# Altium schematic sheet Steering Wheel Carrier Board Mezzanine.SchDoc: Steering Wheel Interface - Mezzanine
size B; Organization: Midnight Sun Solar Rayce Car Team; Address1: University of Waterloo; Address2: 200 University Ave W; Address3: Waterloo, ON, Canada; Address4: N2L 3E9; DocumentNumber: 1; SheetNumber: 1; SheetTotal: 5; Website: www.uwmidsun.com; ProjectName: ProjectName
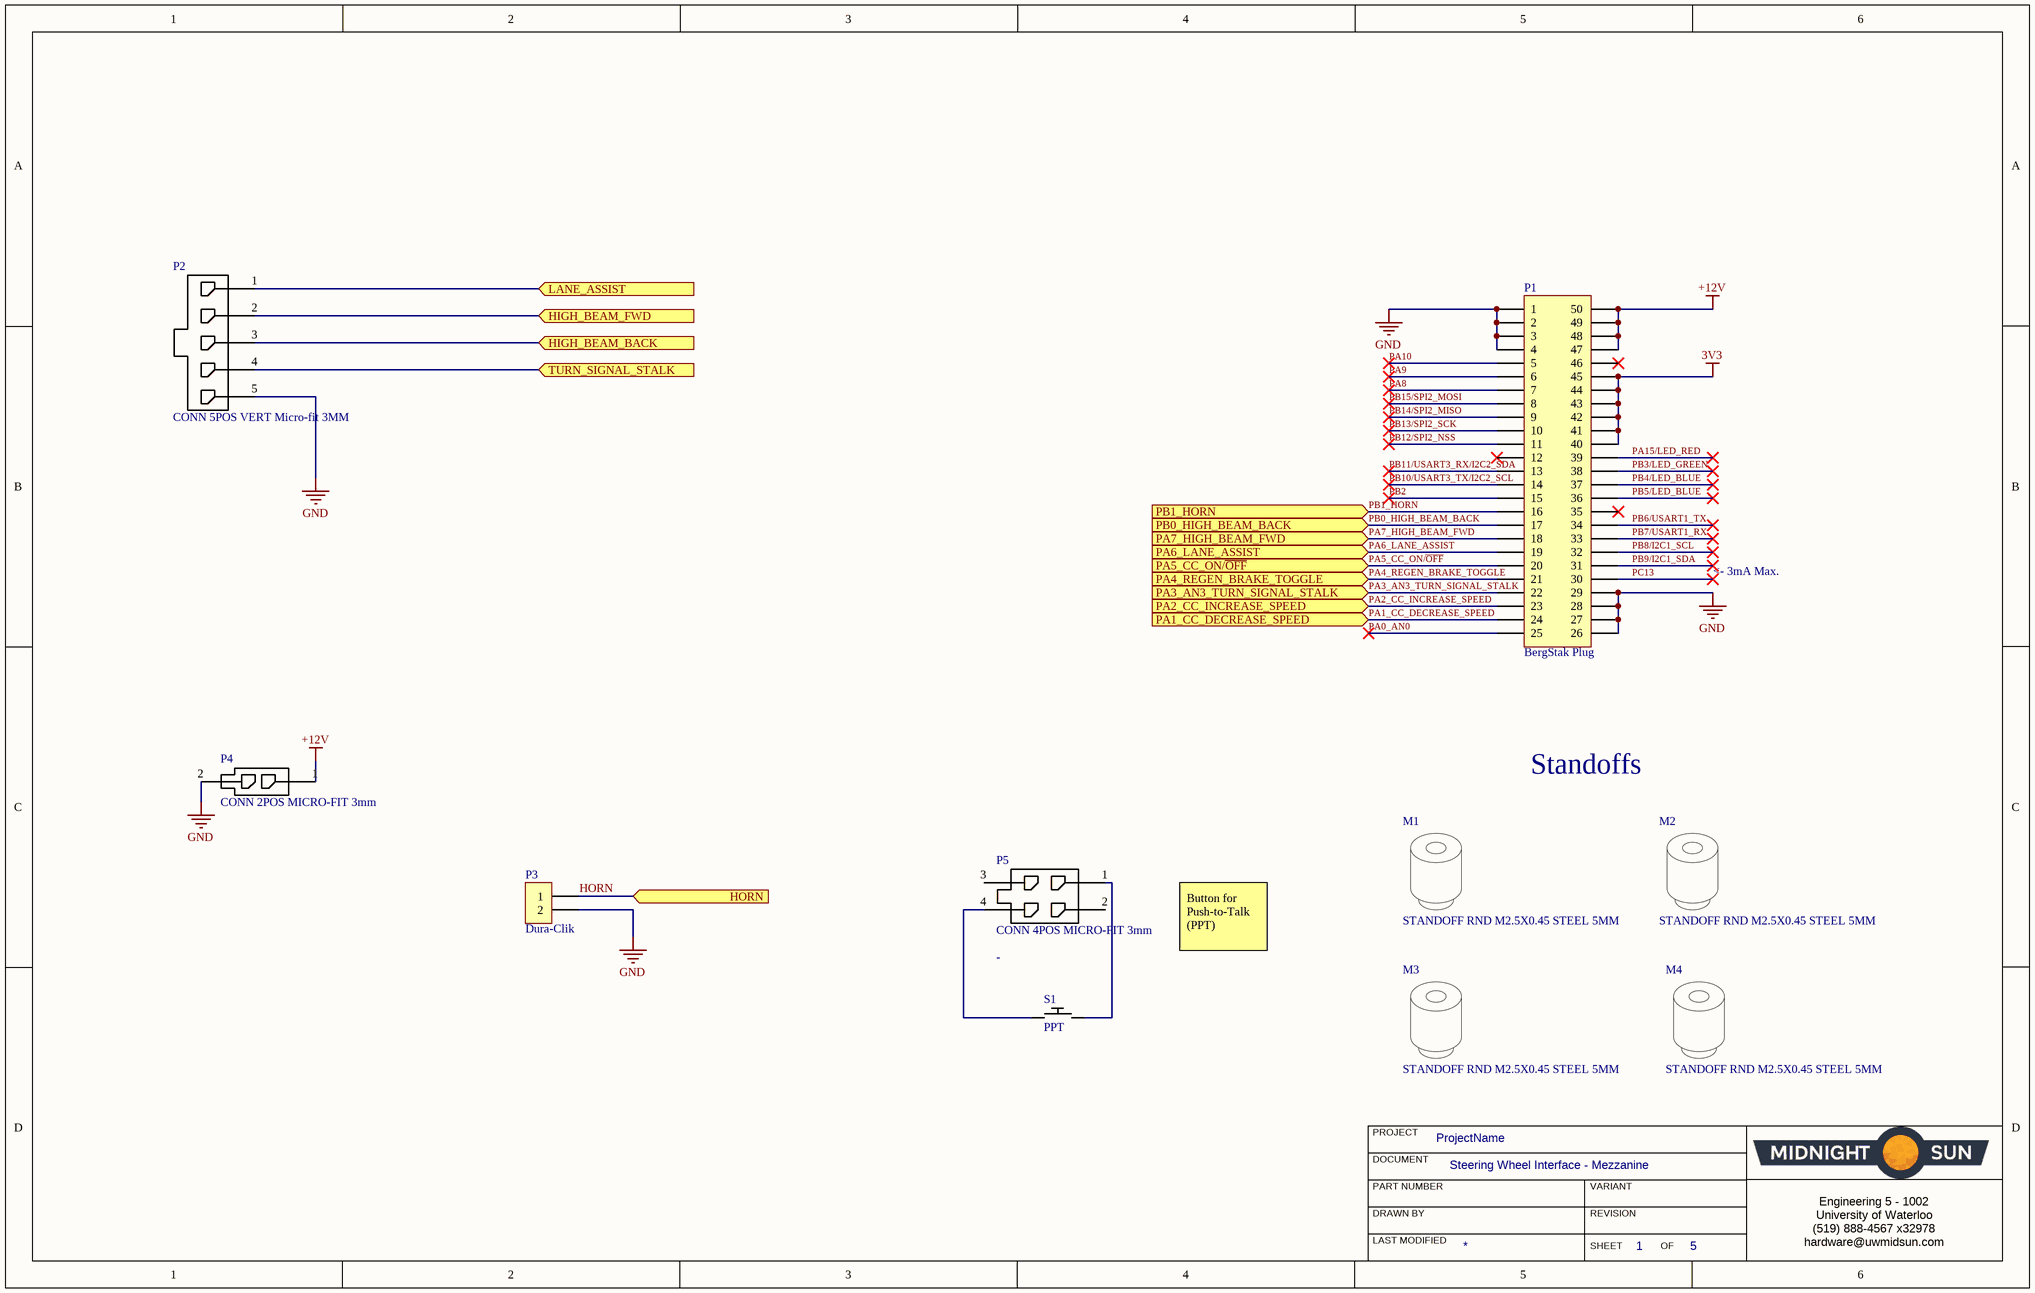
[diagram p0: Steering Wheel Carrier Board Mezzanine.SchDoc]

## Parts
M1  STANDOFF RND M2.5X0.45 STEEL 5MM  [M2.5 Standoff]
M2  STANDOFF RND M2.5X0.45 STEEL 5MM  [M2.5 Standoff]
M3  STANDOFF RND M2.5X0.45 STEEL 5MM  [M2.5 Standoff]
M4  STANDOFF RND M2.5X0.45 STEEL 5MM  [M2.5 Standoff]
P1  Series: BergStak Plug  [CONN, Bergstak 50 Pos Plug]  (hidden comment: CONN 50POS Bergstak Plug 0.02")
P2  CONN 5POS VERT Micro-fit 3MM  [CONN, 5POS MICRO-FIT 3mm]
P3  Dura-Clik  [CONN, 2POS Dura-Click Vertical]
P4  CONN 2POS MICRO-FIT 3mm  [CONN, 2POS MICRO-FIT]
P5  CONN 4POS MICRO-FIT 3mm  [CONN 4POS MICROFIT (2x2)]
S1  PPT  [SW SPST-NO ESE-20C321]

## Ports
HIGH_BEAM_BACK (in), HIGH_BEAM_FWD (in), HORN (in), LANE_ASSIST (in), PA1_CC_DECREASE_SPEED (in), PA2_CC_INCREASE_SPEED (in), PA3_AN3_TURN_SIGNAL_STALK (in), PA4_REGEN_BRAKE_TOGGLE (in), PA5_CC_ON/~{OFF} (in), PA6_LANE_ASSIST (in), PA7_HIGH_BEAM_FWD (in), PB0_HIGH_BEAM_BACK (in), PB1_HORN (in), TURN_SIGNAL_STALK (in)

## Nets
3V3: P1.40 P1.41 P1.42 P1.43 P1.44 P1.45
+12V: P1.47 P1.48 P1.49 P1.50 P4.1
GND: P1.1 P1.2 P1.3 P1.4 P1.26 P1.27 P1.28 P1.29 P2.5 P3.2 P4.2
HIGH_BEAM_BACK: P2.3 ; port HIGH_BEAM_BACK
HIGH_BEAM_FWD: P2.2 ; port HIGH_BEAM_FWD
HORN: P3.1 ; port HORN
LANE_ASSIST: P2.1 ; port LANE_ASSIST
PA0_AN0: P1.25
PA1_CC_DECREASE_SPEED: P1.24 ; port PA1_CC_DECREASE_SPEED
PA2_CC_INCREASE_SPEED: P1.23 ; port PA2_CC_INCREASE_SPEED
PA3_AN3_TURN_SIGNAL_STALK: P1.22 ; port PA3_AN3_TURN_SIGNAL_STALK
PA4_REGEN_BRAKE_TOGGLE: P1.21 ; port PA4_REGEN_BRAKE_TOGGLE
PA5_CC_ON/~{OFF}: P1.20 ; port PA5_CC_ON/~{OFF}
PA6_LANE_ASSIST: P1.19 ; port PA6_LANE_ASSIST
PA7_HIGH_BEAM_FWD: P1.18 ; port PA7_HIGH_BEAM_FWD
PA8: P1.7
PA9: P1.6
PA10: P1.5
PA15/LED_RED: P1.39
PB0_HIGH_BEAM_BACK: P1.17 ; port PB0_HIGH_BEAM_BACK
PB1_HORN: P1.16 ; port PB1_HORN
PB2: P1.15
PB3/LED_GREEN: P1.38
PB4/LED_BLUE: P1.37
PB5/LED_BLUE: P1.36
PB6/USART1_TX: P1.34
PB7/USART1_RX: P1.33
PB8/I2C1_SCL: P1.32
PB9/I2C1_SDA: P1.31
PB10/USART3_TX/I2C2_SCL: P1.14
PB11/USART3_RX/I2C2_SDA: P1.13
PB12/SPI2_NSS: P1.11
PB13/SPI2_SCK: P1.10
PB14/SPI2_MISO: P1.9
PB15/SPI2_MOSI: P1.8
PC13: P1.30
TURN_SIGNAL_STALK: P2.4 ; port TURN_SIGNAL_STALK
NetP5_1: P5.1 S1.2
NetP5_4: P5.4 S1.1

Not connected (* = marked no-connect by the designer): P1 12* 35* 46*; P5 2 3

## Notes on the sheet
- <- 3mA Max.
- (near M2) Standoffs
- Button for Push-to-Talk (PPT)
- PROJECT
- DOCUMENT
- DRAWN BY
- LAST MODIFIED
- PART NUMBER
- REVISION
- SHEET
- VARIANT
- OF
- Engineering 5 - 1002
  University of Waterloo
  (519) 888-4567 x32978
  hardware@uwmidsun.com

## Library data of the parts
M1-M4 = CMP-003-0255-1: Manufacturer: Wurth Electronics; Manufacturer Part Number: 9774050151R; Plating: Tin; Outside Diameter: 0.201inch; Threaded/Unthreaded: Threaded; Pricing 1: 1 = 1.09000, 10 = 1.03000, 50 = 0.91800, 100 = 0.84000 (USD); Material: Steel; Stock 1: 24846; Design Item ID: STANDOFF RND M2.5X0.45 STEEL 5MM; REACH SVHC: Unknown; Source: Schematic Diagrams.SchLib; RoHS: Yes; Length: 0.252inch
P1 = CONN 50POS Bergstak Plug 0.02": 50 Position Connector Plug, Outer Shroud Contacts Surface Mount Gold; Manufacturer 1: Amphenol FCI; Manufacturer Part Number 1: 10132797-055100LF; Number of Positions: 50; Mated Stacking Heights: 5mm; Pitch: 0.020" (0.50mm); Supplier 1: Digi-Key; Supplier Part Number 1: 609-5226-1-ND; Packaging: Cut Tape (CT); Part Status: Active; Connector Type: Plug, Outer Shroud Contacts; Number of Rows: 2; Mounting Type: Surface Mount; Contact Finish: Gold; Contact Finish Thickness: 1µin (0.025µm); Height Above Board: 0.169" (4.30mm); ComponentLink1URL: http://portal.fciconnect.com/Comergent//fci/drawing/10132797.pdf; ComponentLink1Description: http://portal.fciconnect.com/Comergent//fci/drawing/10132797.pdf
P2 = CMP-022-0000-1: Conn Power HDR 5 POS 3mm Solder ST Thru-Hole 5 Terminal 1 Port Micro-Fit 3.0™ Tray; Manufacturer Part Number: 0436500516; Manufacturer: Molex; Max Voltage Rating (AC): 250V; Connector Type: Male Pin; Number of Contacts: 5; Number of Ports: 1; Min Operating Temperature: -40°C; Source: SchlibSolarSense.SchLib; Design Item ID: CONN 5POS VERT Micro-fit 3MM; Number of Terminals: 5; Stock 1: 1615; Orientation: Straight; Contact Plating: Gold; Contact Material: Brass; Number of Rows: 1; Fastening Type: Ramp; Max Operating Temperature: 105°C; Termination: Solder; Mount: Through Hole; ComponentLink1URL: https://datasheet.ciiva.com/6813/436500516-sd-6813986.pdf?src-supplier=Digi-Key; Color: Black; Length: 18.65mm; ComponentLink1Description: https://datasheet.ciiva.com/6813/436500516-sd-6813986.pdf?src-supplier=Digi-Key; Number of Positions: 5; ComponentLink2URL: https://datasheet.ciiva.com/3943/304280436500516-pcb-headers-3943315.pdf?src-supplier=Arrow; Packaging: Tray; Pitch: 3mm; Housing Material: Polymer; RoHS: Yes; ComponentLink2Description: https://datasheet.ciiva.com/3943/304280436500516-pcb-headers-3943315.pdf?src-supplier=Arrow; Pricing 1: 1=1.52000, 10=1.38200, 100=1.18480, 500=0.98736, 1000=0.84630, 5000=0.75039, 10000=0.73346 (USD); Depth: 5.57mm
P3 = CONN 2POS DURA-CLIK 0.079" VERT: 2 Positions Header, Shrouded Connector 0.079" (2.00mm) Surface Mount, Vertical Tin; Manufacturer: Molex, LLC; Manufacturer Part Number: 5600200220; Style: Board to Cable/Wire; Shrouding: Shrouded - 4 Wall; Number of Positions: 2; Number of Positions Loaded: All; Mated Stacking Heights: 9.3mm; Supplier 1: Digi-Key; RoHS: RoHS Compliant; Category: Connectors, Interconnects; Stock 1: 11912; Pricing 1: 1=1.16, 10=1.012, 25=0.952, 50=0.9122, 100=0.8727, 250=0.79336 (CAD); Packaging: Cut Tape (CT); Part Status: Active; Connector Type: Header; Contact Type: Male Pin; Pitch - Mating: 0.079" (2.00mm); Number of Rows: 1; Row Spacing - Mating: -; Mounting Type: Surface Mount; Termination: Solder; Fastening Type: Latch Lock; Contact Length - Mating: -; Contact Length - Post: -; Overall Contact Length: -; Insulation Height: 0.315" (8.00mm); Contact Shape: Square; Contact Finish - Mating: Tin; Contact Finish Thickness - Mating: -; Contact Finish - Post: Tin; Contact Material: Copper Alloy; Insulation Material: Polyamide (PA), Nylon; Features: Solder Retention; Operating Temperature: -; Ingress Protection: -; Material Flammability Rating: -; Insulation Color: Natural; Current Rating: -; Voltage Rating: -; Contact Finish Thickness - Post: -; Applications: Automotive, Industrial; ComponentLink1URL: http://www.molex.com/pdm_docs/sd/5600200220_sd.pdf; ComponentLink1Description: http://www.molex.com/pdm_docs/sd/5600200220_sd.pdf; Supplier Part Number 1: WM10862CT-ND
P4 = CMP-007-0003-1: Connector Header Through Hole 2 position; Manufacturer: Molex; Manufacturer Part Number: 43045-0227; Number of Ports: 1; Number of Contacts: 2; Glow Wire Compliant: Compliant; Voltage Rating: 600V; Current Rating: 5A; Max Voltage Rating (DC): 250.25kV; Gender: Male; Contact Resistance: 10mR; ComponentLink3URL: http://uk.rs-online.com/webdocs/13c3/0900766b813c3a46.pdf; Contact Material: Brass; Halogen Free: Low Halogen; ComponentLink2URL: http://www.mouser.com/ds/2/276/0430450227_PCB_HEADERS-142611.pdf; Length: 7.15mm; Source: Schematic Diagrams.SchLib; Min Operating Temperature: -40°C; Contact Plating: Tin; Number of Terminals: 2; Number of Rows: 2; Radiation Hardening: No; ComponentLink4URL: http://www.molex.com/webdocs/datasheets/pdf/en-us/0430450227_PCB_HEADERS.pdf; Packaging: Tray; Depth: 8.77mm; Pitch: 3mm; Stock 1: 3657; Mount: Through Hole; Max Operating Temperature: 105°C; ComponentLink1Description: http://www.onlinecomponents.com/productFiles/mf-MOL/307170430450227_pcb_headers.pdf; Orientation: Vertical; Row Spacing: 3mm; Case/Package: 3168; Pricing 1: 1=0.84, 10=0.74, 25=0.6968, 50=0.6676, 100=0.6387, 250=0.5806, 500=0.52254, 1000=0.46448, 2500=0.42094 (USD); ComponentLink2Description: http://www.mouser.com/ds/2/276/0430450227_PCB_HEADERS-142611.pdf; ComponentLink3Description: http://uk.rs-online.com/webdocs/13c3/0900766b813c3a46.pdf; ComponentLink1URL: http://www.onlinecomponents.com/productFiles/mf-MOL/307170430450227_pcb_headers.pdf; Number of Positions: 2; Design Item ID: CONN 2POS MICRO-FIT 3mm; Housing Colour: Black; Termination: Solder; Number of Circuits: 2; ComponentLink4Description: http://www.molex.com/webdocs/datasheets/pdf/en-us/0430450227_PCB_HEADERS.pdf; Housing Material: Thermoplastic
P5 = CMP-003-0192-1: Micro-Fit 3.0 Vertical Header, 3.00mm Pitch, Dual Row, 4 Circuits, with PCB Polarizing Peg, Tin, Glow-Wire Capable, Black; Manufacturer: Molex, LLC; Manufacturer Part Number: 430450427; Contact Resistance: 10mR; Pitch - Mating: 0.118" (3.00mm); Number of Contacts: 4; Number of Ports: 1; Number of Positions: 6; Row Spacing: 0.118inch; Style: Board to Cable/Wire; Shrouding: Shrouded - 4 Wall; Material Flammability Rating: UL94 V-0; Contact Length - Post: 0.125" (3.18mm); Number of Positions Loaded: All; Contact Finish Thickness - Post: -; RoHS: RoHS Compliant; Ingress Protection: -; Number of Rows: 2; Operating Temperature: -; Contact Material: Brass; Contact Finish - Mating: Tin; Mounting Type: Through Hole; Current Rating: -; Overall Contact Length: -; Insulation Material: Liquid Crystal Polymer (LCP), Glass Filled; Design Item ID: CONN 4POS MICRO-FIT 3mm; Voltage Rating: -; Depth: 8.77mm; Part Status: Active; ComponentLink1Description: http://www.molex.com/webdocs/datasheets/pdf/en-us/0430450427_PCB_HEADERS.pdf; Pitch: 3mm; Packaging: Tray; Mated Stacking Heights: -; Contact Length - Mating: -; Features: Board Guide; Row Spacing - Mating: 0.118" (3.00mm); Fastening Type: Locking Ramp; Orientation: Straight; Length: 10.15mm; Housing Material: Polymer; Mount: Through Hole; Insulation Height: 0.390" (9.91mm); Termination: Solder; Connector Type: Header; Package Quantity: 2232; Housing Color: Black; Contact Plating: Tin; ComponentLink1URL: http://www.molex.com/webdocs/datasheets/pdf/en-us/0430450427_PCB_HEADERS.pdf; Number of Terminals: 4; Insulation Color: Black; Source: Schematic Diagrams.SchLib; Contact Finish Thickness - Mating: 60.0µin (1.52µm); Contact Finish - Post: Tin; Min Operating Temperature: -40°C; Contact Type: Male Pin; Max Operating Temperature: 105°C; Contact Shape: Square; Color: Black; Applications: General Purpose, Medical, Military, Telecommunications
S1 = SW PUSH SPST-NO 0.1A 14V: Pushbutton Switch SPST-NO Standard Through Hole; Manufacturer: Panasonic; Manufacturer Part Number: ESE20C321; Switch Function: Off-Mom; Actuator Type: Square, Button; Operating Force: 4N; Voltage Rating (DC): 14V; Throw Configuration: SPST; Current Rating: 100mA; Supplier 1: Digi-Key; Supplier Part Number 1: P11161S-ND; RoHS: Yes; Stock 1: 1919; Pricing 1: 1 = 1.17000, 10 = 1.09200, 25 = 1.04040, 50 = 0.98820, 100 = 0.96220, 250 = 0.93620, 500 = 0.88418, 1000 = 0.83216, 5000 = 0.70214 (USD); Packaging: Bulk; ComponentLink1URL: https://www.digikey.ca/product-detail/en/panasonic-electronic-components/ESE-20C321/P11161S-ND/354749; ComponentLink1Description: Digikey; Mount: Through Hole; Min Operating Temperature: -30°C; Max Operating Temperature: 80°C; Max Voltage Rating (DC): 14V; Package Quantity: 1200; Contact Current Rating: 100mA; Termination: PC Pin; Orientation: Straight; Radiation Hardening: No; REACH SVHC: No SVHC; Lead Free: Lead Free; ComponentLink2URL: https://datasheet.ciiva.com/46399/1790644-46399477.pdf?src-supplier=Element14; ComponentLink2Description: https://datasheet.ciiva.com/46399/1790644-46399477.pdf?src-supplier=Element14; ComponentLink3URL: https://datasheet.ciiva.com/16437/atu0000ce7-16437878.pdf?src-supplier=Future+Electronics; ComponentLink3Description: https://datasheet.ciiva.com/16437/atu0000ce7-16437878.pdf?src-supplier=Future+Electronics; ComponentLink4URL: https://datasheet.ciiva.com/8663/atu0000ce7-8663607.pdf?src-supplier=Avnet; ComponentLink4Description: https://datasheet.ciiva.com/8663/atu0000ce7-8663607.pdf?src-supplier=Avnet; ComponentLink5URL: https://datasheet.ciiva.com/2869/atu0000ce7-2869467.pdf?src-supplier=Digi-Key; ComponentLink5Description: https://datasheet.ciiva.com/2869/atu0000ce7-2869467.pdf?src-supplier=Digi-Key